# Altium schematic sheet prototype_dual_channel.SchDoc
size A
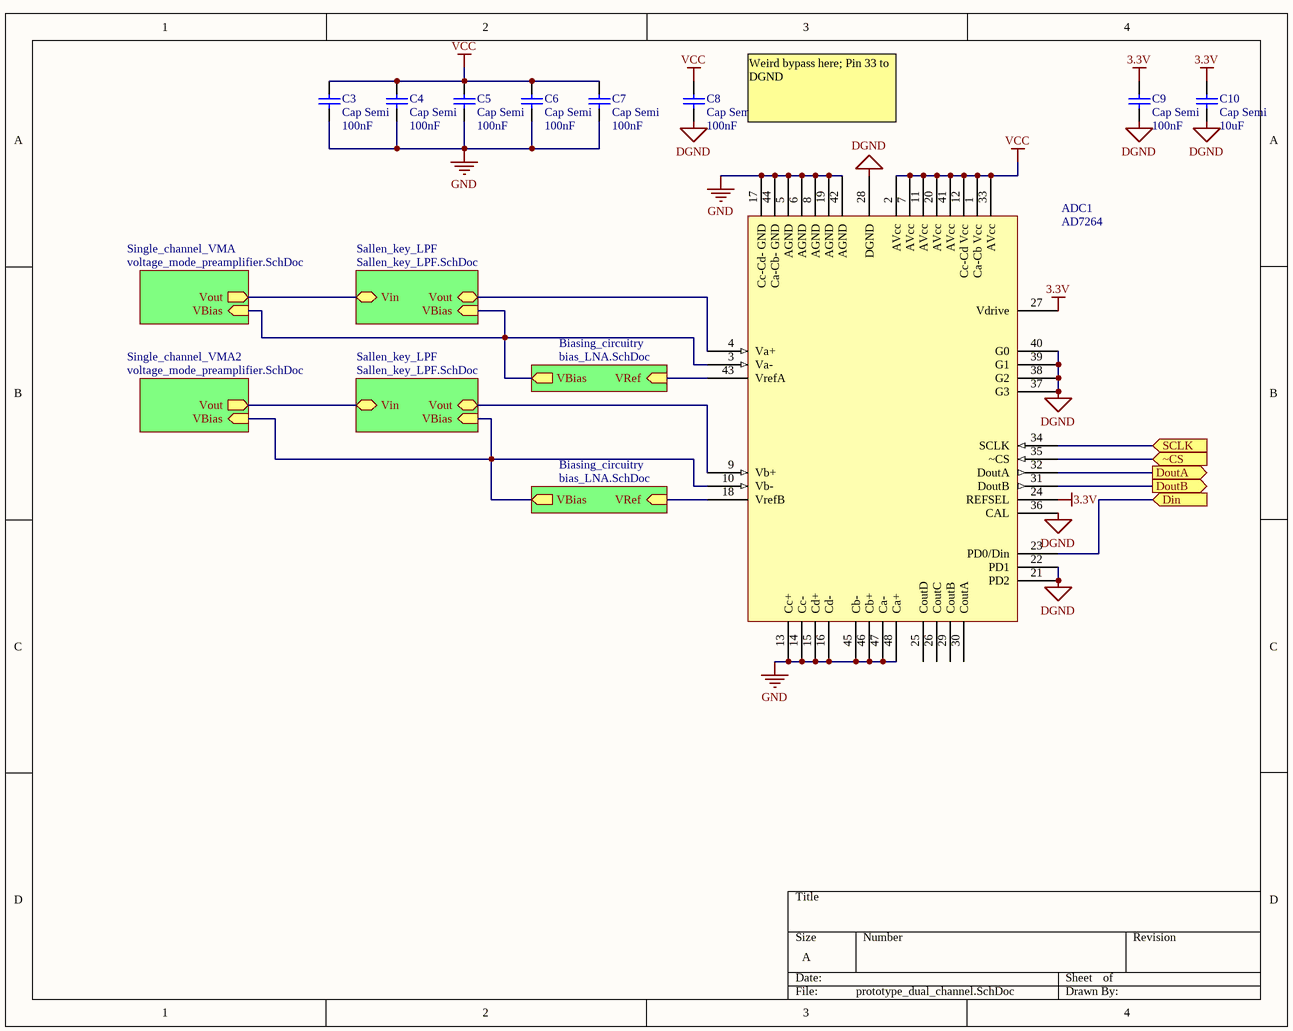
[diagram p0: prototype_dual_channel.SchDoc]

## Parts
ADC1  AD7264  [TSQFP50P900X900-48N]
C3  Cap Semi  value 100nF  [C0805]
C4  Cap Semi  value 100nF  [C0805]
C5  Cap Semi  value 100nF  [C0805]
C6  Cap Semi  value 100nF  [C0805]
C7  Cap Semi  value 100nF  [C0805]
C8  Cap Semi  value 100nF  [C0805]
C9  Cap Semi  value 100nF  [C0805]
C10  Cap Semi  value 10uF  [C0805]

## Sub-sheets
Biasing_circuitry = bias_LNA.SchDoc: VRef (in), VBias (out)
Biasing_circuitry = bias_LNA.SchDoc: VRef (in), VBias (out)
Sallen_key_LPF = Sallen_key_LPF.SchDoc: VBias (in), Vin, Vout
Sallen_key_LPF = Sallen_key_LPF.SchDoc: VBias (in), Vin, Vout
Single_channel_VMA = voltage_mode_preamplifier.SchDoc: Vout (out), VBias (in)
Single_channel_VMA2 = voltage_mode_preamplifier.SchDoc: Vout (out), VBias (in)

## Ports
Din (in), DoutA (out), DoutB (out), SCLK (in), ~CS (in)

## Nets
3.3V: ADC1.24(REFSEL) ADC1.27(Vdrive) C9.2 C10.2
DGND: ADC1.21(PD2) ADC1.22(PD1) ADC1.28(DGND) ADC1.36(CAL) ADC1.37(G3) ADC1.38(G2) ADC1.39(G1) ADC1.40(G0) C8.1 C9.1 C10.1
GND: ADC1.5(AGND) ADC1.6(AGND) ADC1.8(AGND) ADC1.13(Cc+) ADC1.14(Cc-) ADC1.15(Cd+) ADC1.16(Cd-) ADC1.17(Cc-Cd-_GND) ADC1.19(AGND) ADC1.42(AGND) ADC1.44(Ca-Cb-_GND) ADC1.45(Cb-) ADC1.46(Cb+) ADC1.47(Ca-) ADC1.48(Ca+) C3.1 C4.1 C5.1 C6.1 C7.1
VCC: ADC1.1(Ca-Cb_Vcc) ADC1.2(AVcc) ADC1.7(AVcc) ADC1.11(AVcc) ADC1.12(Cc-Cd_Vcc) ADC1.20(AVcc) ADC1.33(AVcc) ADC1.41(AVcc) C3.2 C4.2 C5.2 C6.2 C7.2 C8.2
Din: ADC1.23(PD0/Din) ; port Din
DoutA: ADC1.32(DoutA) ; port DoutA
DoutB: ADC1.31(DoutB) ; port DoutB
SCLK: ADC1.34(SCLK) ; port SCLK
~CS: ADC1.35(~CS) ; port ~CS
NetADC1_3: ADC1.3(Va-) ; sheet Single_channel_VMA/VBias, sheet Sallen_key_LPF/VBias, sheet Biasing_circuitry/VBias
NetADC1_4: ADC1.4(Va+) ; sheet Sallen_key_LPF/Vout
NetADC1_9: ADC1.9(Vb+) ; sheet Sallen_key_LPF/Vout
NetADC1_10: ADC1.10(Vb-) ; sheet Single_channel_VMA2/VBias, sheet Sallen_key_LPF/VBias, sheet Biasing_circuitry/VBias
NetADC1_18: ADC1.18(VrefB) ; sheet Biasing_circuitry/VRef
NetADC1_43: ADC1.43(VrefA) ; sheet Biasing_circuitry/VRef
(unnamed): sheet Single_channel_VMA/Vout, sheet Sallen_key_LPF/Vin
(unnamed): sheet Single_channel_VMA2/Vout, sheet Sallen_key_LPF/Vin

Not connected (* = marked no-connect by the designer): ADC1 25(CoutD) 26(CoutC) 29(CoutB) 30(CoutA)

## Notes on the sheet
- Weird bypass here; Pin 33 to DGND

## Library data of the parts
ADC1 = AD7264: AD7264 - 14 bit 1MSPS 2 channel ADC
C3-C10 = Cap Semi: Capacitor (Semiconductor SIM Model); Published: 8-Jun-2000; LatestRevisionDate: 29-May-2009; LatestRevisionNote: IPC-7351 Footprint Added.; PackageReference: C1206; Publisher: Altium Limited; PackageDescription: Chip Capacitor